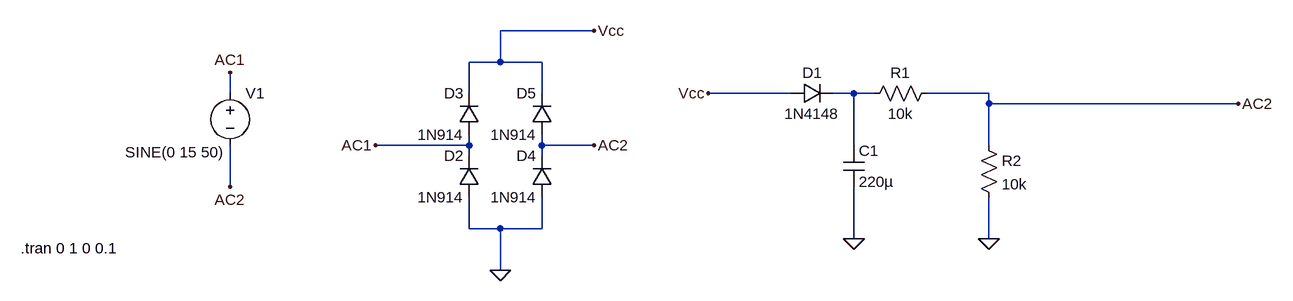
[diagram p0: schematic VoltageSensor.asc]
VoltageSensor.asc, the LTspice schematic file:
Version 4
SHEET 1 1000 680
WIRE -64 -144 -208 -144
WIRE -208 -96 -208 -144
WIRE -208 -96 -256 -96
WIRE -144 -96 -208 -96
WIRE -624 -48 -624 -80
WIRE -256 -48 -256 -96
WIRE -144 -48 -144 -96
WIRE 240 -48 112 -48
WIRE 336 -48 304 -48
WIRE 368 -48 336 -48
WIRE 544 -48 448 -48
WIRE 544 -32 544 -48
WIRE 928 -32 544 -32
WIRE -256 32 -256 16
WIRE -256 32 -400 32
WIRE -144 32 -144 16
WIRE -64 32 -144 32
WIRE 336 32 336 -48
WIRE 544 32 544 -32
WIRE -256 48 -256 32
WIRE -144 48 -144 32
WIRE -624 96 -624 32
WIRE -256 160 -256 112
WIRE -208 160 -256 160
WIRE -144 160 -144 112
WIRE -144 160 -208 160
WIRE 336 176 336 96
WIRE 544 176 544 112
WIRE -208 224 -208 160
FLAG 544 176 0
FLAG 112 -48 Vcc
FLAG 336 176 0
FLAG -624 -80 AC1
FLAG -624 96 AC2
FLAG -400 32 AC1
FLAG -64 32 AC2
FLAG -64 -144 Vcc
FLAG -208 224 0
FLAG 928 -32 AC2
SYMBOL diode 240 -32 R270
WINDOW 0 32 32 VTop 2
WINDOW 3 0 32 VBottom 2
SYMATTR InstName D1
SYMATTR Value 1N4148
SYMBOL diode -240 112 R180
WINDOW 0 24 64 Left 2
WINDOW 3 24 0 Left 2
SYMATTR InstName D2
SYMATTR Value 1N914
SYMBOL diode -240 16 R180
WINDOW 0 24 64 Left 2
WINDOW 3 24 0 Left 2
SYMATTR InstName D3
SYMATTR Value 1N914
SYMBOL diode -128 112 R180
WINDOW 0 24 64 Left 2
WINDOW 3 24 0 Left 2
SYMATTR InstName D4
SYMATTR Value 1N914
SYMBOL diode -128 16 R180
WINDOW 0 24 64 Left 2
WINDOW 3 24 0 Left 2
SYMATTR InstName D5
SYMATTR Value 1N914
SYMBOL voltage -624 -64 R0
WINDOW 3 -161 107 Left 2
WINDOW 123 0 0 Left 2
WINDOW 39 0 0 Left 2
SYMATTR InstName V1
SYMATTR Value SINE(0 15 50)
SYMBOL res 464 -64 R90
WINDOW 0 0 56 VBottom 2
WINDOW 3 32 56 VTop 2
SYMATTR InstName R1
SYMATTR Value 10k
SYMBOL cap 320 32 R0
SYMATTR InstName C1
SYMATTR Value 220µ
SYMATTR SpiceLine V=50
SYMBOL res 528 16 R0
SYMATTR InstName R2
SYMATTR Value 10k
TEXT -946 190 Left 2 !.tran 0 1 0 0.1

The netlist it stands for:
* VoltageSensor.asc
D1 Vcc N001 1N4148
D2 0 AC1 1N914
D3 AC1 Vcc 1N914
D4 0 AC2 1N914
D5 AC2 Vcc 1N914
V1 AC1 AC2 SINE(0 15 50)
R1 AC2 N001 10k
C1 N001 0 220µ V=50
R2 AC2 0 10k
.model D D
.lib standard.dio
.tran 0 1 0 0.1
.backanno
.end